# EAGLE design rely pcb (EAGLE 9.3.0)
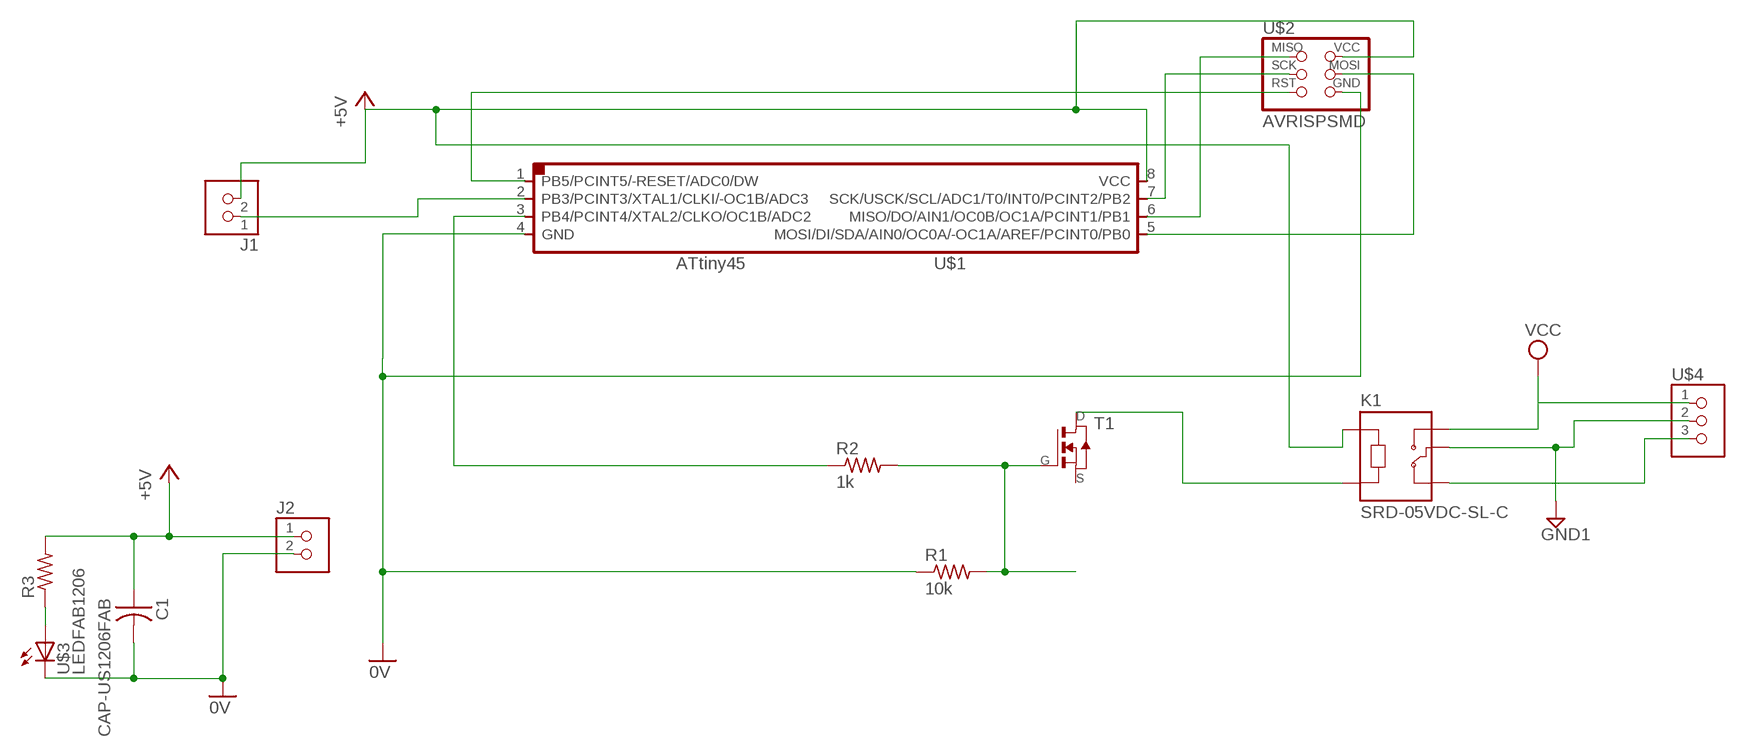
[diagram p0: schematic, sheet 1]

## Parts
C1  CAP-US1206FAB  [C1206FAB]
J1  TERM-1X02-ADAFRUIT  [3.5MMTERM]
J2  TERM-1X02-ADAFRUIT  [3.5MMTERM]
K1  SRD-05VDC-SL-C  [RELAY_SRD-05VDC-SL-C]
R1  10k  RES-US1206FAB  [R1206FAB]
R2  1k  RES-US1206FAB  [R1206FAB]
R3  RES-US1206FAB  [R1206FAB]
T1  NMOSFETTO252  [TO252]
U$1  ATTINY45SI  [SOIC8]
U$2  AVRISPSMD  [2X03SMD]
U$3  LEDFAB1206  [LED1206FAB]
U$4  TERM-1X03'-FABLAB'  [ED555DS-3DS]

## Nets
0V: C1.2 J2.2 R1.1 U$1.4(GND) U$2.6(GND) U$3.2(C)
+5V: C1.1 J1.2 J2.1 K1.A1 R3.2 U$1.8(VCC) U$2.2(VCC)
GND1: K1.COM U$4.2
N$1: U$1.6(MISO/DO/AIN1/OC0B/OC1A/PCINT1/PB1) U$2.1(MISO)
N$2: U$1.5(MOSI/DI/SDA/AIN0/OC0A/-OC1A/AREF/PCINT0/PB0) U$2.4(MOSI)
N$3: R2.1 U$1.3(PB4/PCINT4/XTAL2/CLKO/OC1B/ADC2)
N$4: U$1.7(SCK/USCK/SCL/ADC1/T0/INT0/PCINT2/PB2) U$2.3(SCK)
N$5: U$1.1(PB5/PCINT5/-RESET/ADC0/DW) U$2.5(RST)
N$7: K1.A2 T1.3(D)
N$8: R1.2 R2.2 T1.1(G)
N$10: R3.1 U$3.1(A)
N$11: J1.1 U$1.2(PB3/PCINT3/XTAL1/CLKI/-OC1B/ADC3)
N$12: K1.NC U$4.3
VCC: K1.NO U$4.1
Unconnected: T1.2(S)

## Library data of the parts
C1 = fab:CAP-US
J1 J2 = fab:TERM-1X02: 3.5mm terminal block, 2 positions ED555-2DS as found in the fablab inventory. Stolen from Adafruit <http://www.ladyada.net/library/pcb/eaglelibrary.html>, adapted by Zaerc.
K1 = SRD-05VDC-SL-C:SRD-05VDC-SL-C: 5V Trigger Relay Module For Arduino And Raspberry Pi 5V Trigger Relay Module For Arduino And Raspberry Pi; AVAILABILITY: Unavailable; DESCRIPTION: 5V Trigger Relay Module For Arduino And Raspberry Pi 5V Trigger Relay Module For Arduino And Raspberry Pi; MF: Songle Relay; MP: SRD-05VDC-SL-C; PACKAGE: None; PRICE: None
R1-R3 = fab:RES-US: Resistor (US Symbol) Variants with postfix FAB are widened to allow the routing of internal traces
T1 = fab:NMOSFET: MOS FET
U$1 = fab:ATTINY45
U$2 = fab:AVRISP
U$3 = fab:LED: LED
U$4 = fab:TERM-1X03: 3.5mm terminal block, 3 positions ED555-3DS as found in the fablab inventory. Made by Zaerc.

## Net classes
0 default: width 0.508 mm

## Board
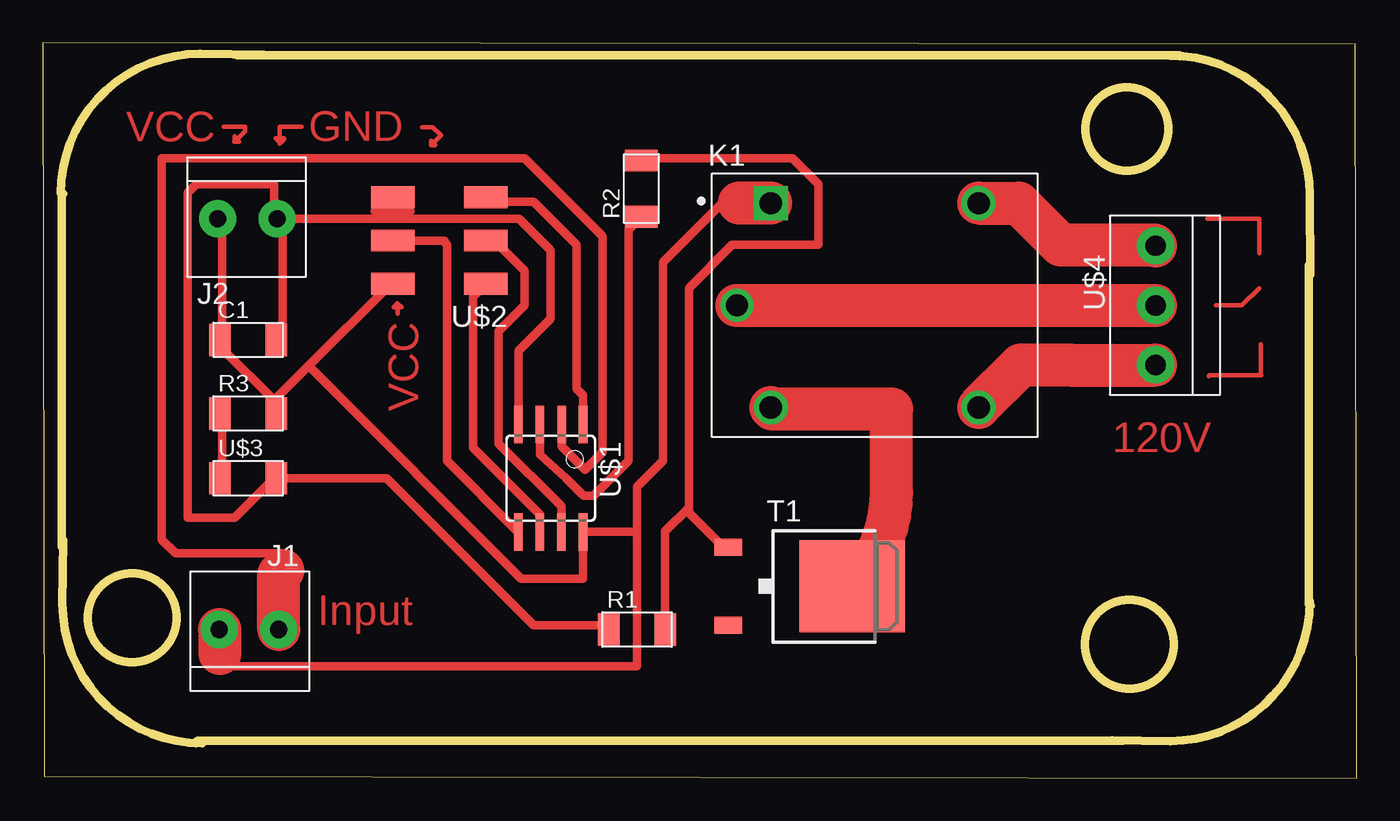
[diagram p1: board, top side]

Size 77.27 x 43.23 mm. Coordinates in mm from the lower left corner, seen from the top.
Outline: 0.1,0.1 77.27,0 77.17,43.13 0,43.23 0.1,0.1
Copper layers (1*16): Top 0.035mm / dielectric 1.5mm / Bottom 0.035mm
Design rules "default": minimum track width 6mil, minimum drill 0.35mm, track to track 6mil, track to pad 6mil, pad to pad 6mil, via to via 6mil, smd to smd 6mil, copper to edge 40mil, drill to drill 6mil, minimum pad ring 10mil, minimum via ring 8mil, stop-mask expansion 4mil, vias tented up to drill 0mil, thermal gap 10mil
Milling: area 61.3,35.7 to 66.2,40.6; area 61.3,5.3 to 66.5,10.5; area 2.7,6.8 to 7.9,12; 16 lines

### Footprints (pad centres in the part's own frame; a part is rotated, then mirrored left to right if it is on the bottom)
C1206FAB = smd 1.27 x 1.905: 1 -1.651,0; 2 1.651,0
3.5MMTERM = drill 1 pad 2.184: 1 1.8,0; 2 -1.7,0
RELAY_SRD-05VDC-SL-C = drill 1.32 square: A1 -6.1,6 | drill 1.32: A2 -6.1,-6; NC 6.1,6; NO 6.1,-6 | drill 1.29: COM -8.1,0
R1206FAB = smd 1.27 x 1.905: 1 -1.651,0; 2 1.651,0
TO252 = smd 1 x 1.6: 1 -2.28,-4.8; 2 2.28,-4.8 | smd 5.4 x 6.2: 3 0,2.5
SOIC8 = smd 0.5 x 2.2: 1 -1.905,-3.154; 2 -0.645,-3.154; 3 0.625,-3.154; 4 1.895,-3.154; 5 1.905,3.154; 6 0.635,3.154; 7 -0.635,3.154; 8 -1.905,3.154
2X03SMD = smd 2.54 x 1.27: 1 -2.54,2.54; 2 2.92,2.54; 3 -2.54,0; 4 2.92,0; 5 -2.54,-2.54; 6 2.92,-2.54
LED1206FAB = smd 1.27 x 1.905: 1 -1.651,0; 2 1.651,0
ED555DS-3DS = drill 1.2 pad 2.184: 1 -3.5,0; 2 0,0; 3 3.5,0

### Placement (x,y rotation side)
C1  12.09,25.76 0 top
J1  12.09,8.74 0 top
J2  12.09,32.87 180 top
K1  48.92,27.79 0 top
R1  34.95,8.74 0 top
R2  35.2,34.65 90 top
R3  12.09,21.44 0 top
T1  45.11,11.28 270 top
U$1  29.87,17.63 180 top
U$2  23.52,31.6 180 top
U$3  12.09,17.63 0 top
U$4  65.43,27.79 90 top

### Tracks (layer width: path | path; a pad name or v marks a point on that pad's centre or on a via)
0V
  Top 0.508: R1.1 32.92,8.99 28.85,8.99 20.22,17.63 U$3.2 13.61,17.63 11.3,15.32 8.53,15.32 8.53,34.39 9.04,34.9 13.61,34.9 13.61,32.87 J2.2 14.12,32.87 | 14.12,32.87 14.12,25.76 C1.2 | U$1.4 27.98,25.11 29.87,27 29.87,31.01 28.02,32.87 20.73,32.87 | 20.73,32.87 20.73,33.88 U$2.6 | 20.73,32.87 14.12,32.87
+5V
  Top 0.508: 13.61,22.2 10.57,25.25 10.57,25.76 | 13.61,22.2 13.61,21.69 R3.2 13.61,22.2 | 13.61,22.2 15.65,24.23 | 15.65,24.23 20.22,28.8 U$2.2 | 10.57,25.76 10.57,32.87 J2.1 | 10.57,25.76 C1.1 | 40.97,33.79 39.93,33.79 36.47,30.33 36.47,18.64 34.95,17.12 34.95,14.53 | 34.95,14.53 34.89,14.47 U$1.8 31.78,11.73 28.14,11.73 15.65,24.23 | 34.95,14.53 34.95,6.58 10.48,6.58 10.39,6.7 J1.2
  Top 2.54: K1.A1 40.97,33.79 | J1.2 10.41,8.71 10.41,7.32
GND1
  Top 2.54: K1.COM U$4.2
N$1
  Top 0.508: U$1.6 29.24,14.8 29.26,14.83 29.26,15.47 25.3,19.43 25.3,28.3 U$2.1
N$2
  Top 0.508: U$1.5 27.84,14.58 23.77,18.64 23.77,31.34 23.6,31.51 23.64,31.6 U$2.4
N$3
  Top 0.508: R2.1 34.44,32.23 34.44,18.64 32.42,16.62 arc-45 32.4,16.61 31.81,16.61 arc-45 31.79,16.62 30.78,17.63 29.25,19.02 U$1.3
N$4
  Top 0.508: U$1.7 30.51,15.98 26.82,19.66 26.82,26.26 28.35,27.79 28.35,29.82 26.57,31.6 U$2.3
N$5
  Top 0.508: U$1.1 31.78,22.5 31.39,22.89 31.39,31.34 28.85,33.88 26.31,33.88 U$2.5
N$7
  Top 2.54: T1.3 47.64,11.31 arc45 49.91,16.79 49.91,21.69 42.93,21.69 arc-45 42.91,21.7 K1.A2
N$8
  Top 0.508: 36.98,8.99 R1.2 36.6,14.5 38,15.9 | 38,15.9 38,28.8 40.54,31.34 45.62,31.34 45.62,34.9 44.09,36.42 35.08,36.42 R2.2 | 38,15.9 38,15.6 40.03,13.56 T1.1
N$9
  Top 0.508: 21.64,33.32 19.69,33.32 19.53,33.32
N$10
  Top 0.508: U$3.1 10.57,17.63 10.57,21.18 R3.1
N$11
  Top 0.508: U$1.2 30.52,19.53 arc45 30.52,19.52 31.9,18.14 32.92,19.15 32.92,31.85 28.35,36.42 7.01,36.42 7.01,14.02 7.82,13.21 14.12,13.21 14.12,12.22
  Top 2.54: J1.1 13.89,11.99 14.12,12.22
N$12
  Top 2.54: K1.NC 57.39,33.79 arc-45 57.41,33.78 59.84,31.34 65.36,31.34 arc-45 65.38,31.34 U$4.3
N$13
  Top 0.254: 68.99,27.79 70.51,27.79 71.53,28.8
N$14
  Top 0.254: 68.48,32.87 71.53,32.87 71.53,30.84
N$15
  Top 0.254: 15.24,38.28 13.94,38.28 13.94,37.35 | 13.94,37.29 13.94,37.35 | 13.94,37.35 arc45 13.94,37.37 13.72,37.59 14.2,37.59 14.2,37.55 arc-45 14.19,37.53 14,37.34
N$16
  Top 0.254: 22.3,38.25 22.93,38.25 arc-45 22.94,38.24 23.42,37.77 22.83,37.19 22.83,37.46 23.08,37.22 arc-45 23.09,37.2 23.09,37.19 22.86,37.19
N$17
  Top 0.254: 10.64,38.28 11.91,38.28 11.91,38.03 arc-45 11.91,38.02 11.35,37.46 11.31,37.51 arc-45 11.3,37.53 11.3,37.65 | 11.3,37.72 11.3,37.65 | 11.3,37.65 arc45 11.31,37.64 11.56,37.39 11.28,37.39
N$18
  Top 0.254: 20.88,27.28 20.88,27.89 21.07,27.69 arc45 21.09,27.69 | 21.09,27.69 21.11,27.69 | 21.09,27.69 20.66,27.69 arc45 20.64,27.68 | 20.64,27.68 20.62,27.66 | 20.64,27.68 20.85,27.88 arc45 20.85,27.9 20.85,27.91
N$19
  Top 0.254: 68.55,23.62 arc-90 68.61,23.67 71.65,23.67 arc-90 71.63,23.7 71.63,25.5
VCC
  Top 2.54: 57.53,24.29 arc45 57.51,24.28 | 57.51,24.28 K1.NO | 60.41,24.29 arc-45 60.39,24.28 | 60.39,24.28 57.51,24.28 | 60.39,24.28 65.41,24.28 arc45 U$4.1

### Text on the board
Top: VCC | GND | VCC | 120V | Input